# EAGLE design Turnstile Swing Revision (EAGLE 9.6.2)
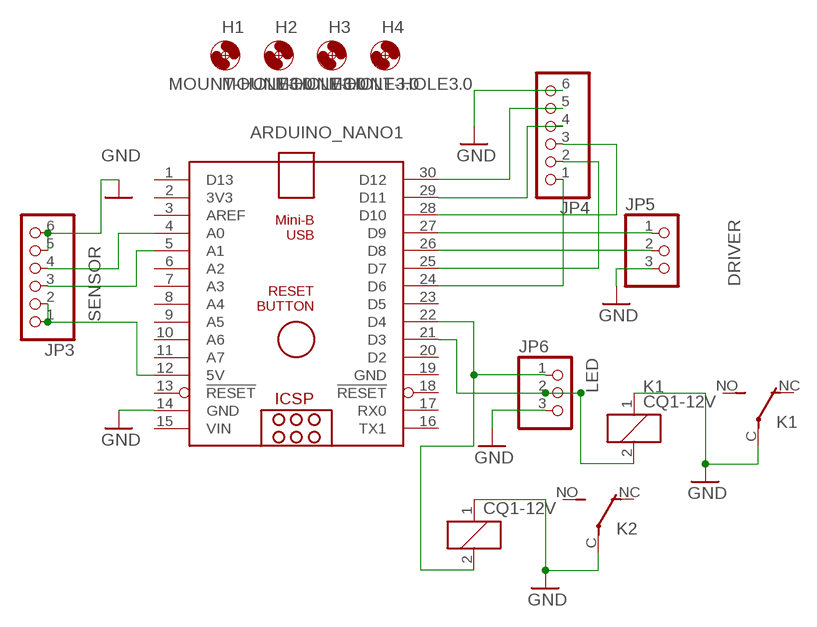
[diagram p0: schematic, sheet 1]

## Parts
ARDUINO_NANO1  ARDUINO_NANO  [ARDUINO_NANO]
H1  MOUNT-HOLE3.0  [3,0]
H2  MOUNT-HOLE3.0  [3,0]
H3  MOUNT-HOLE3.0  [3,0]
H4  MOUNT-HOLE3.0  [3,0]
JP3  PINHD-1X6  [1X06]
JP4  PINHD-1X6  [1X06]
JP5  PINHD-1X3  [1X03]
JP6  PINHD-1X3  [1X03]
K1  CQ1-12V  [CQ1]
K2  CQ1-12V  [CQ1]

## Nets
GND: ARDUINO_NANO1.14(GND) JP3.5 JP3.6 JP4.6 JP5.3 JP6.3 K1.1 K1.C(2:P) K2.1 K2.C(2:P)
N$1: ARDUINO_NANO1.12(5V) JP3.1 JP3.2
N$2: ARDUINO_NANO1.5(A1) JP3.3
N$3: ARDUINO_NANO1.4(A0) JP3.4
N$4: ARDUINO_NANO1.24(D6) JP4.1
N$5: ARDUINO_NANO1.26(D8) JP5.2
N$6: ARDUINO_NANO1.27(D9) JP5.1
N$7: ARDUINO_NANO1.21(D3) JP6.2 K1.2
N$8: ARDUINO_NANO1.22(D4) JP6.1 K2.2
N$9: ARDUINO_NANO1.25(D7) JP4.2
N$10: ARDUINO_NANO1.28(D10) JP4.3
N$11: ARDUINO_NANO1.29(D11) JP4.4
N$12: ARDUINO_NANO1.30(D12) JP4.5
Unconnected: ARDUINO_NANO1.1(D13) ARDUINO_NANO1.2(3V3) ARDUINO_NANO1.3(AREF) ARDUINO_NANO1.6(A2) ARDUINO_NANO1.7(A3) ARDUINO_NANO1.8(A4) ARDUINO_NANO1.9(A5) ARDUINO_NANO1.10(A6) ARDUINO_NANO1.11(A7) ARDUINO_NANO1.13(!RESET) ARDUINO_NANO1.16(TX1) ARDUINO_NANO1.17(RX0) ARDUINO_NANO1.18(!RESET) ARDUINO_NANO1.20(D2) ARDUINO_NANO1.23(D5) K1.NC(2:O) K1.NO(2:S) K2.NC(2:O) K2.NO(2:S)

## Notes on the sheet
- DRIVER
- SENSOR
- LED

## Power pins joined to a net without a drawn wire
GND: ARDUINO_NANO1.19(GND)
VIN: ARDUINO_NANO1.15(VIN)

## Library data of the parts
ARDUINO_NANO1 = ArduinoNanoV30:ARDUINO_NANO: Arduino Nano V3.0 Overview: The Arduino Nano is a small, complete, and breadboard-friendly board based on the ATmega328 (Arduino Nano 3.x) or ATmega168 (Arduino Nano 2.x). It has more or less the same functionality of the Arduino Duemilanove, but in a different package. It lacks only a DC power jack, and works with a Mini-B USB cable instead of a standard one. The Nano was designed and is being produced by Gravitech. Specifications: Microcontroller Atmel ATmega168 or ATmega328 Operating Voltage (logic level) 5 V Input Voltage (recommended) 7-12 V Input Voltage (limits) 6-20 V Digital I/O Pins 14 (of which 6 provide PWM output) Analog Input Pins 8 DC Current per I/O Pin 40 mA Flash Memory 16 KB (ATmega168) or 32 KB (ATmega328) of which 2 KB used by bootloader SRAM 1 KB (ATmega168) or 2 KB (ATmega328) EEPROM 512 bytes (ATmega168) or 1 KB (ATmega328) Clock Speed 16 MHz Dimensions 0.73" x 1.70" Length 45 mm Width 18 mm Weigth 5 g Power: The Arduino Nano can be powered via the Mini-B USB connection, 6-20V unregulated external power supply (pin 30), or 5V regulated external power supply (pin 27). The power source is automatically selected to the highest voltage source. Memory: The ATmega168 has 16 KB of flash memory for storing code (of which 2 KB is used for the bootloader); the ATmega328 has 32 KB, (also with 2 KB used for the bootloader). The ATmega168 has 1 KB of SRAM and 512 bytes of EEPROM (which can be read and written with the EEPROM library); the ATmega328 has 2 KB of SRAM and 1 KB of EEPROM. Input and Output: Each of the 14 digital pins on the Nano can be used as an input or output, using pinMode(), digitalWrite(), and digitalRead() functions. They operate at 5 volts. Each pin can provide or receive a maximum of 40 mA and has an internal pull-up resistor (disconnected by default) of 20-50 kOhms. In addition, some pins have specialized functions. Visit Arduino - ArduinoBoardNano <https://www.arduino.cc/en/Main/ArduinoBoardNano>
H1-H4 = holes:MOUNT-HOLE: MOUNTING HOLE with drill center marker
JP3 JP4 = pinhead:PINHD-1X6: PIN HEADER
JP5 JP6 = pinhead:PINHD-1X3: PIN HEADER
K1 K2 = relay:CQ1-12V: AUTOMOTIVE QUIET RELAY NAiS Source: http://www.mew-europe.com/.. en_ds_61208_0000.pdf; OC_FARNELL: unknown; OC_NEWARK: unknown

## Net classes
0 default: clearance 0.205 mm

## Board
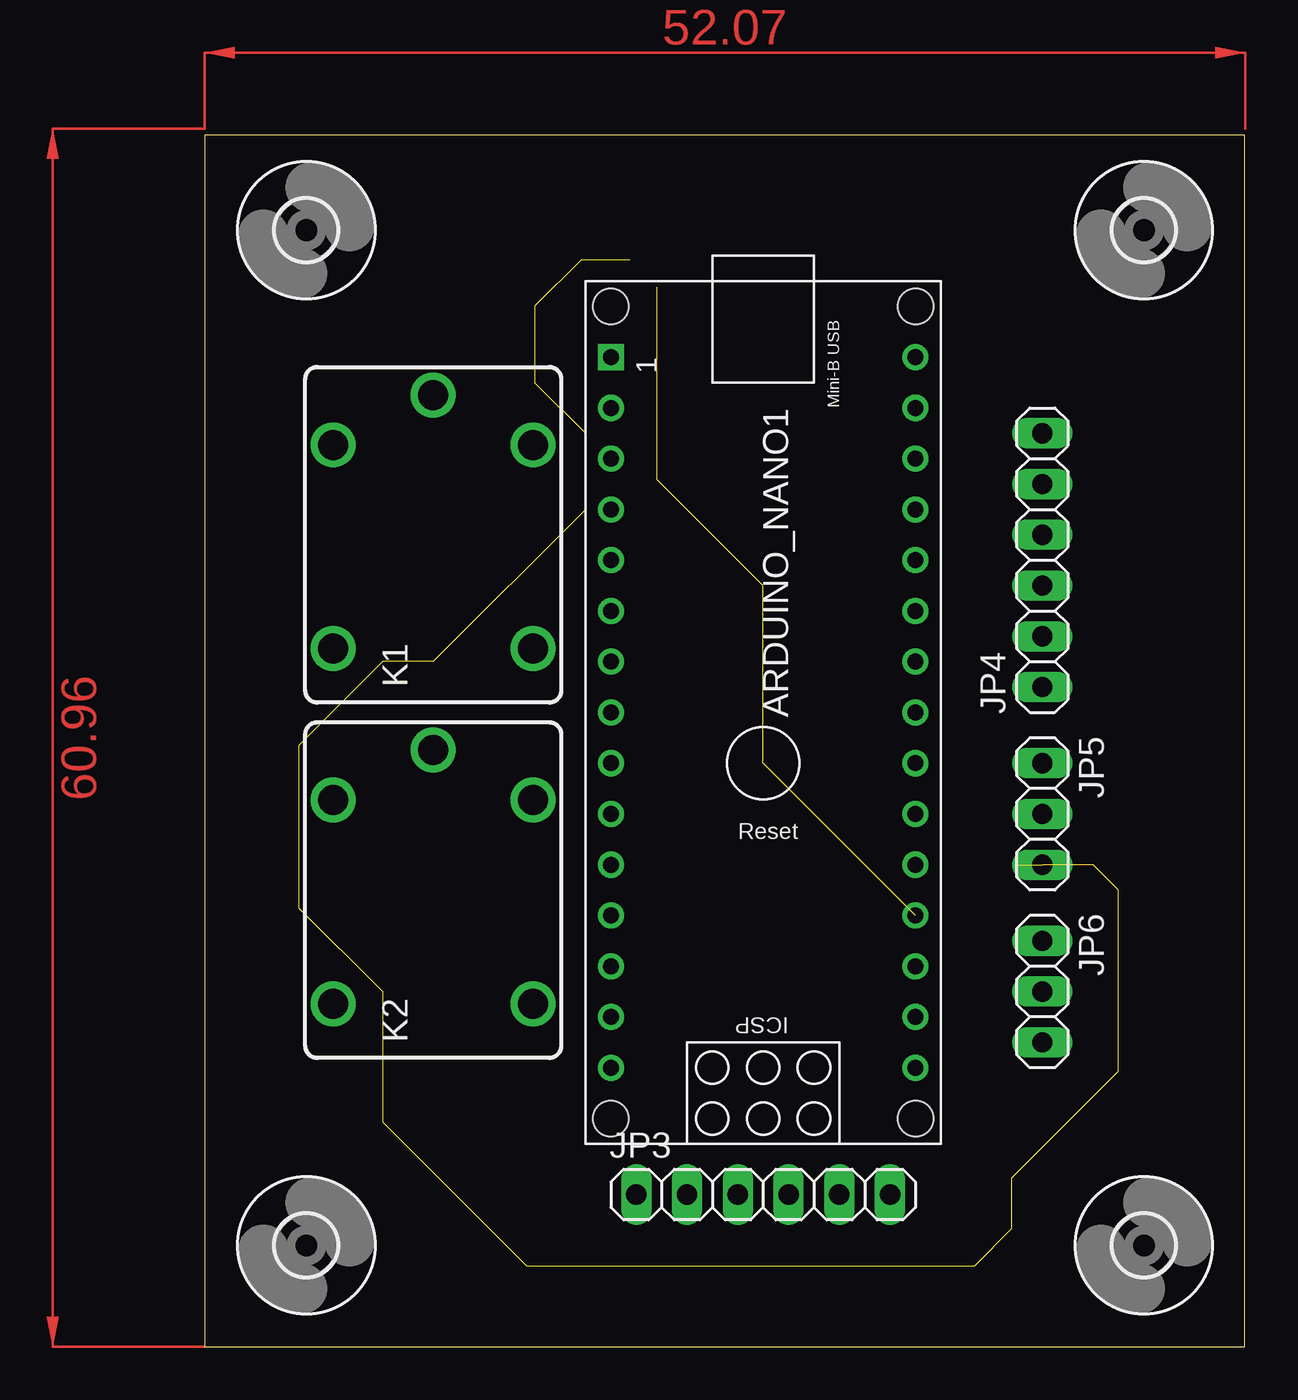
[diagram p1: board, top side]
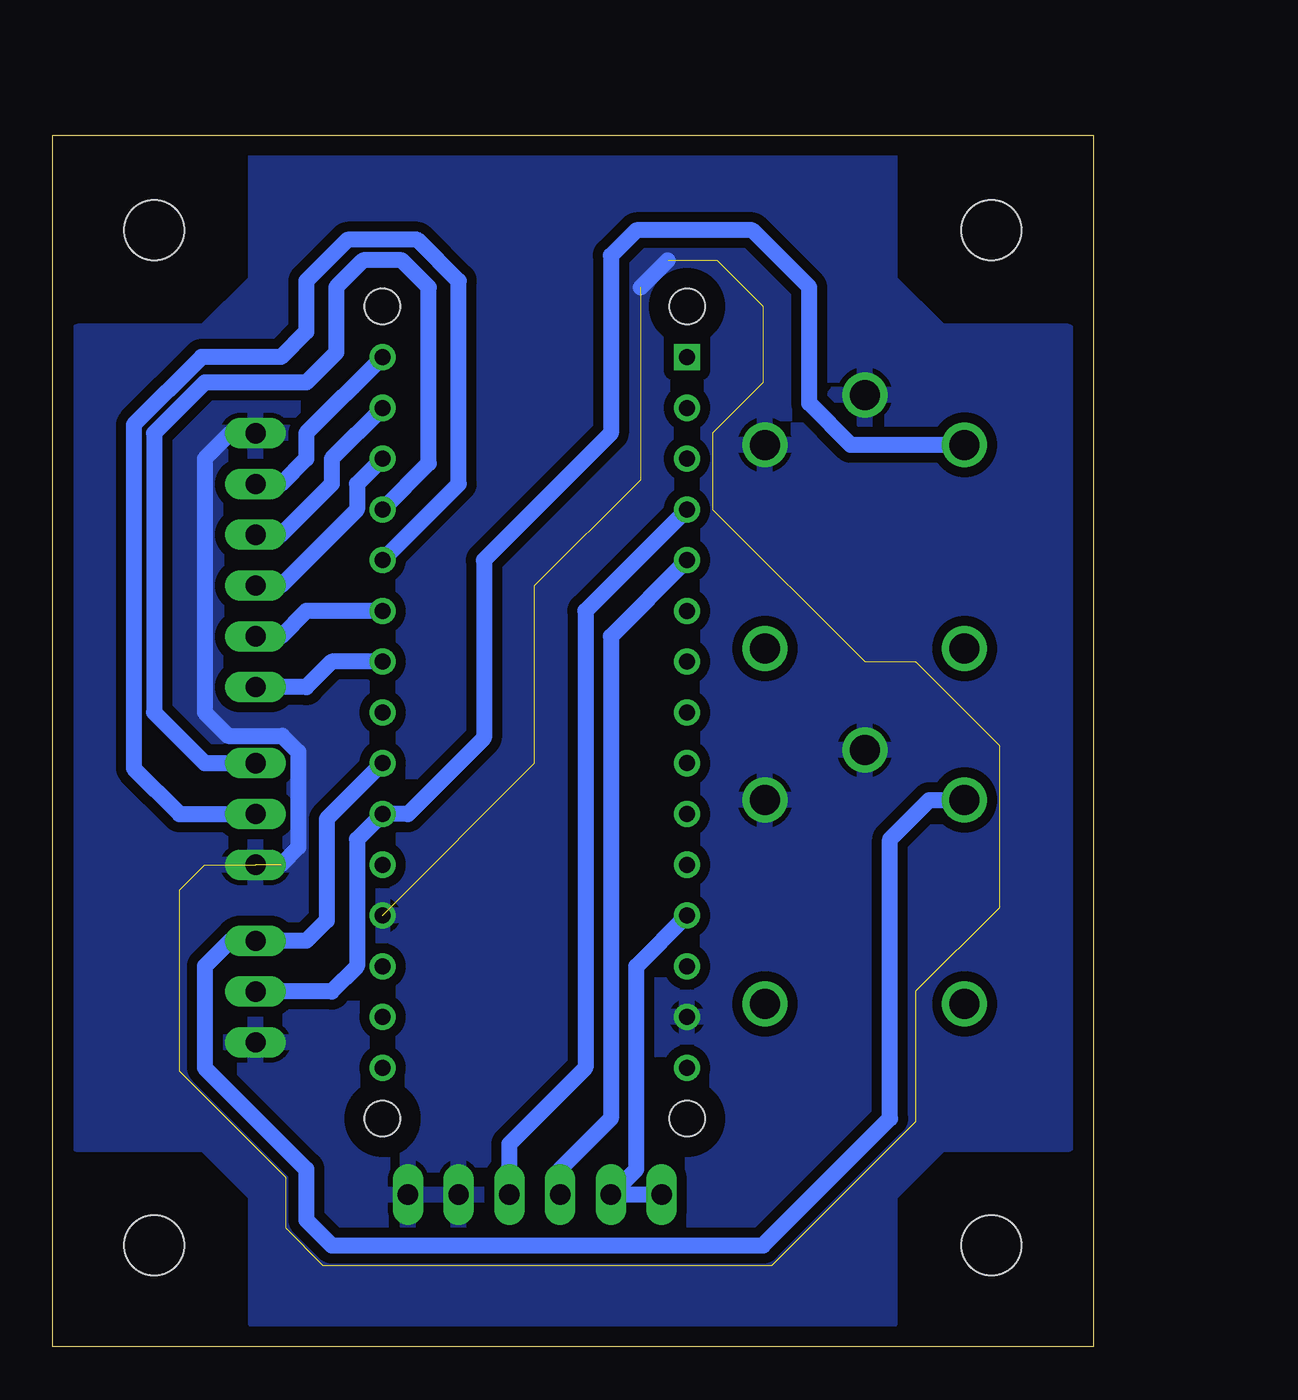
[diagram p2: board, bottom side, seen from below]

Size 52.05 x 60.63 mm. Coordinates in mm from the lower left corner, seen from the top.
Outline: 0,0 52.05,0 52.05,60.63 0,60.63 0,0
Copper layers (1*16): Top 0.035mm / dielectric 1.5mm / Bottom 0.035mm
Design rules "default": minimum track width 6mil, minimum drill 0.35mm, track to track 6mil, track to pad 6mil, pad to pad 6mil, via to via 6mil, smd to smd 6mil, copper to edge 40mil, drill to drill 6mil, minimum pad ring 10mil, minimum via ring 8mil, stop-mask expansion 4mil, vias tented up to drill 0mil, thermal gap 10mil

### Footprints (pad centres in the part's own frame; a part is rotated, then mirrored left to right if it is on the bottom)
ARDUINO_NANO = drill 0.8 square: 1 -20.32,-7.62 | drill 0.8: 2 -17.78,-7.62; 3 -15.24,-7.62; 4 -12.7,-7.62; 5 -10.16,-7.62; 6 -7.62,-7.62; 7 -5.08,-7.62; 8 -2.54,-7.62; 9 0,-7.62; 10 2.54,-7.62; 11 5.08,-7.62; 12 7.62,-7.62; 13 10.16,-7.62; 14 12.7,-7.62; 15 15.24,-7.62; 16 15.24,7.62; 17 12.7,7.62; 18 10.16,7.62; 19 7.62,7.62; 20 5.08,7.62; 21 2.54,7.62; 22 0,7.62; 23 -2.54,7.62; 24 -5.08,7.62; 25 -7.62,7.62; 26 -10.16,7.62; 27 -12.7,7.62; 28 -15.24,7.62; 29 -17.78,7.62; 30 -20.32,7.62 | hole 1.778: -22.86,-7.62; -22.86,7.62; 17.78,7.62; 17.78,-7.62
3,0 = hole 3: 0,0
1X06 = drill 1.016 long: 1 -6.35,0; 2 -3.81,0; 3 -1.27,0; 4 1.27,0; 5 3.81,0; 6 6.35,0
1X03 = drill 1.016 long: 1 -2.54,0; 2 0,0; 3 2.54,0
CQ1 = drill 1.5: 1 4.5,-5; 2 4.5,5; C 7,0; NC -5.7,-5; NO -5.7,5

### Placement (x,y rotation side)
ARDUINO_NANO1  27.94,29.21 270 top
H1  46.99,5.08 0 top
H2  5.08,5.08 0 top
H3  5.08,55.88 0 top
H4  46.99,55.88 0 top
JP3  27.94,7.62 0 top
JP4  41.91,39.37 90 top
JP5  41.91,26.67 270 top
JP6  41.91,17.78 270 top
K1  11.43,40.64 90 top
K2  11.43,22.86 90 top

### Tracks (layer width: path | path; a pad name or v marks a point on that pad's centre or on a via)
GND  (24 unrouted)
  Bottom 0.813: JP4.6 43.18,45.72 44.45,44.45 44.45,31.75 43.28,30.58 40.58,30.58 39.77,29.78 39.77,24.99 40.64,24.13 | 22.63,53.03 21.28,54.38
  pour Bottom (isolate 0.5): 11.43,59.69 41.91,59.69 41.91,54.61 41.91,53.34 44.45,50.8 50.8,50.8 50.8,10.16 45.72,10.16 44.45,10.16 41.91,7.62 41.91,1.27 10.16,1.27 10.16,6.35 10.16,7.62 7.62,10.16 1.27,10.16 1.27,50.8 7.62,50.8 10.16,53.34 10.16,59.69
N$1
  Bottom 0.813: ARDUINO_NANO1.12 22.86,19.05 22.86,8.89 JP3.2 JP3.1
N$2
  Bottom 0.813: JP3.3 26.67,8.89 24.13,11.43 24.13,35.56 ARDUINO_NANO1.5
N$3
  Bottom 0.813: JP3.4 29.21,10.16 25.4,13.97 25.4,36.83 ARDUINO_NANO1.4
N$4
  Bottom 0.813: ARDUINO_NANO1.24 38.1,34.29 39.37,33.02 JP4.1
N$5
  Bottom 0.813: ARDUINO_NANO1.26 31.75,43.18 31.75,53.34 33.81,55.4 37.31,55.4 39.37,53.34 39.37,50.8 40.64,49.53 44.62,49.53 48.01,46.14 48.01,28.96 45.72,26.67 JP5.2
N$6
  Bottom 0.813: ARDUINO_NANO1.27 33.25,44.22 33.25,53.03 34.6,54.38 36.52,54.38 37.87,53.03 37.87,49.76 39.37,48.26 44.45,48.26 46.99,45.72 46.99,31.75 44.45,29.21 JP5.1
N$7
  Bottom 0.813: JP6.2 38.1,17.78 36.83,19.05 36.83,25.4 ARDUINO_NANO1.21 34.29,26.67 30.48,30.48 30.48,39.37 24.13,45.72 24.13,54.61 22.86,55.88 17.05,55.88 14.2,53.03 14.2,47.22 12.12,45.14 K1.2
N$8
  Bottom 0.813: ARDUINO_NANO1.22 38.35,26.42 38.35,21.34 39.37,20.32 JP6.1 43.18,20.32 44.45,19.05 44.45,13.97 39.37,8.89 39.37,6.35 38.1,5.08 16.51,5.08 10.16,11.43 10.16,25.4 8.2,27.36 K2.2
N$9
  Bottom 0.813: ARDUINO_NANO1.25 39.37,36.83 40.64,35.56 JP4.2
N$10
  Bottom 0.813: ARDUINO_NANO1.28 36.83,43.18 36.83,41.91 40.64,38.1 JP4.3
N$11
  Bottom 0.813: ARDUINO_NANO1.29 38.1,44.45 38.1,43.18 40.64,40.64 JP4.4
N$12
  Bottom 0.813: ARDUINO_NANO1.30 39.37,45.72 39.37,44.45 40.64,43.18 JP4.5
(copper drawn outside any net)
  shapes: Top area x2